# Altium project SW_Circuit.PrjPcb
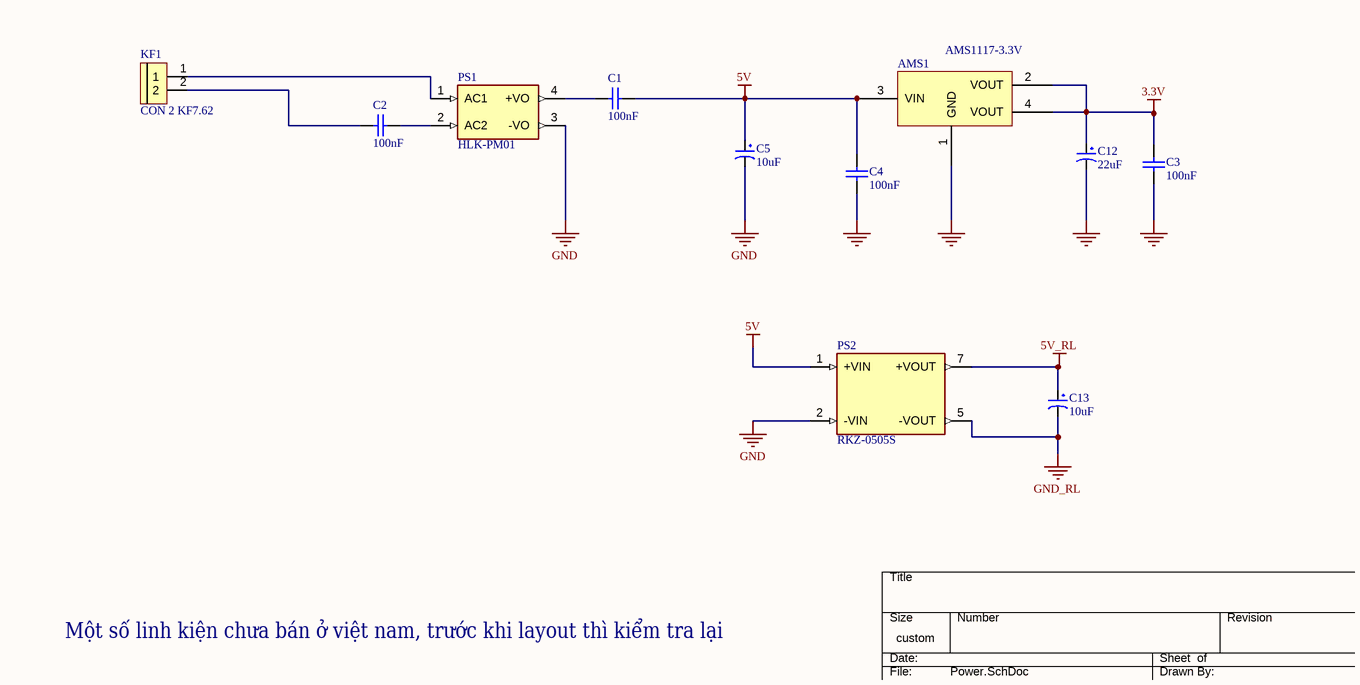
[diagram p0: Power.SchDoc]
3 sheets, 45 parts. Net scope: global (net labels, ports and power ports of the same name join across sheets).
Board file: PCB1.PcbDoc
Sheets:
  Power.SchDoc
  MCU.SchDoc
  Switch.SchDoc

## Sheet Power.SchDoc
size 254 x 127 mm; SheetNumber: 1; SheetTotal: 3

### Parts
(Parts that share a designator on the sheet are numbered #1, #2 ... from top to bottom, then left to right.)
AMS1  AMS1117-3.3V  [SOT223]
C1  100nF  [tu gom]
C2  100nF  [tu gom]
C3  100nF  [tu gom]
C4  100nF  [tu gom]
C5  10uF  [tu hoa 5mm]
C12  22uF  [tu hoa 5mm]
C13  10uF  [tu hoa 5mm]
KF1#1  CON 2 KF7.62  [CON 2 KF7.62]
PS1  HLK-PM01  [CONV_HLK-PM01]
PS2  RKZ-0505S  [CONV_RKZ-0505S]

### Nets
3.3V: AMS1.2(VOUT) AMS1.4(VOUT) C3.1 C12.1
5V: AMS1.3(VIN) C1.2 C4.1 C5.1 PS2.1(+VIN)
5V_RL: C13.1 PS2.7(+VOUT)
GND: AMS1.1(GND) C3.2 C4.2 C5.2 C12.2 PS1.3(-VO) PS2.2(-VIN)
GND_RL: C13.2 PS2.5(-VOUT)
NetC1_1: C1.1 PS1.4(+VO)
NetC2_1: C2.1 KF1#1.2
NetC2_2: C2.2 PS1.2(AC2)
NetKF1#1_1: KF1#1.1 PS1.1(AC1)

### Notes on the sheet
- Một số linh kiện chưa bán ở việt nam, trước khi layout thì kiểm tra lại
- DWG. NO.
- REV.
- SHT.
- THIS DOCUMENT AND THE DATA DISCLOSED HEREIN OR HEREWITH IS THE PROPERTY OF ALTIUM LIMITED AND MAY BE FREELY DISTRIBUTED IN WHOLE. NO RIGHTS ARE RESERVED OR EXPRESS OR IMPLIED WARANTEE GIVEN.
- REVISION
- DESCRIPTION
- DATE
- APPROVED
- ENG:
- APPROVALS
- PROJECT
- DSN:
- CHK:
- REFERENCE DOCUMENTS
- PROJECT REVISION:
- TITLE
- DOCUMENT REVISION:
- DESIGN ITEM:
- BOM:
- FAB DWG:
- PCB DWG:
- ASSY DWG:
- SCALE:
- SIZE
- B
- CAGE CODE
- FILE NAME
- DWG NO.
- SHEET
- OF
- REV

### Library data of the parts
AMS1 = AMS1117 SMD: Dán; Value: AMS1117-3.3V SOT223; Don_Vi: Con; Ma_Hang: MH000596; Ghi_Chu: *; Kieu_Chan: *; Chung_Loai: Dán
C1-C4 = Tu gom 15pF 50V: Cắm; Don_Vi: Con; So_Chan: 2; Ten_Linh_Kien: Tụ gốm 15P 50V; Ma_Hang: MH004767; Chung_Loai: Cắm; Kieu_Chan: *
C5 C12 C13 = Tu Hoa 0.1uF 50V 5x11: Cắm; Don_Vi: Con; So_Chan: 2; Ten_Linh_Kien: Tụ Hóa 0.1uF 50V; Ma_Hang: MH006853; Chung_Loai: Cắm; Kieu_Chan: *
KF1#1 = CON 2 KF7.62: Cắm; Ma_Hang: MH002053; Ten_Linh_Kien: CON 2 KF7.62-2P 7.62MM (Đen Thẳng); Chung_Loai: Cắm; Ghi_Chu: *; Kieu_Chan: *; Don_Vi: Con
PS1 = HLK-PM01: The HLK-PM01 is a small size low cost AC to DC converter which can take in 110V/220V AC at 50/60 Hz and give 5V 3W output. The module is can be used in designs which run on 5V and needs to be powered form the AC mains.; MF: Hi-link; SnapEDA_Link: https://www.snapeda.com/parts/hlk-pm01/Hi-link/view-part/?ref=snap; Package: None; Value: *; MP: hlk-pm01; Check_prices: https://www.snapeda.com/parts/hlk-pm01/Hi-link/view-part/?ref=eda
PS2 = RKZ-0505S: RKZ Series 2 W Single Output 5 V DC/DC Converter - SIP-7; Package: None; Price: None; Value: *; MP: RKZ-0505S; Availability: Unavailable

## Sheet MCU.SchDoc
size A; SheetNumber: 2; SheetTotal: 3
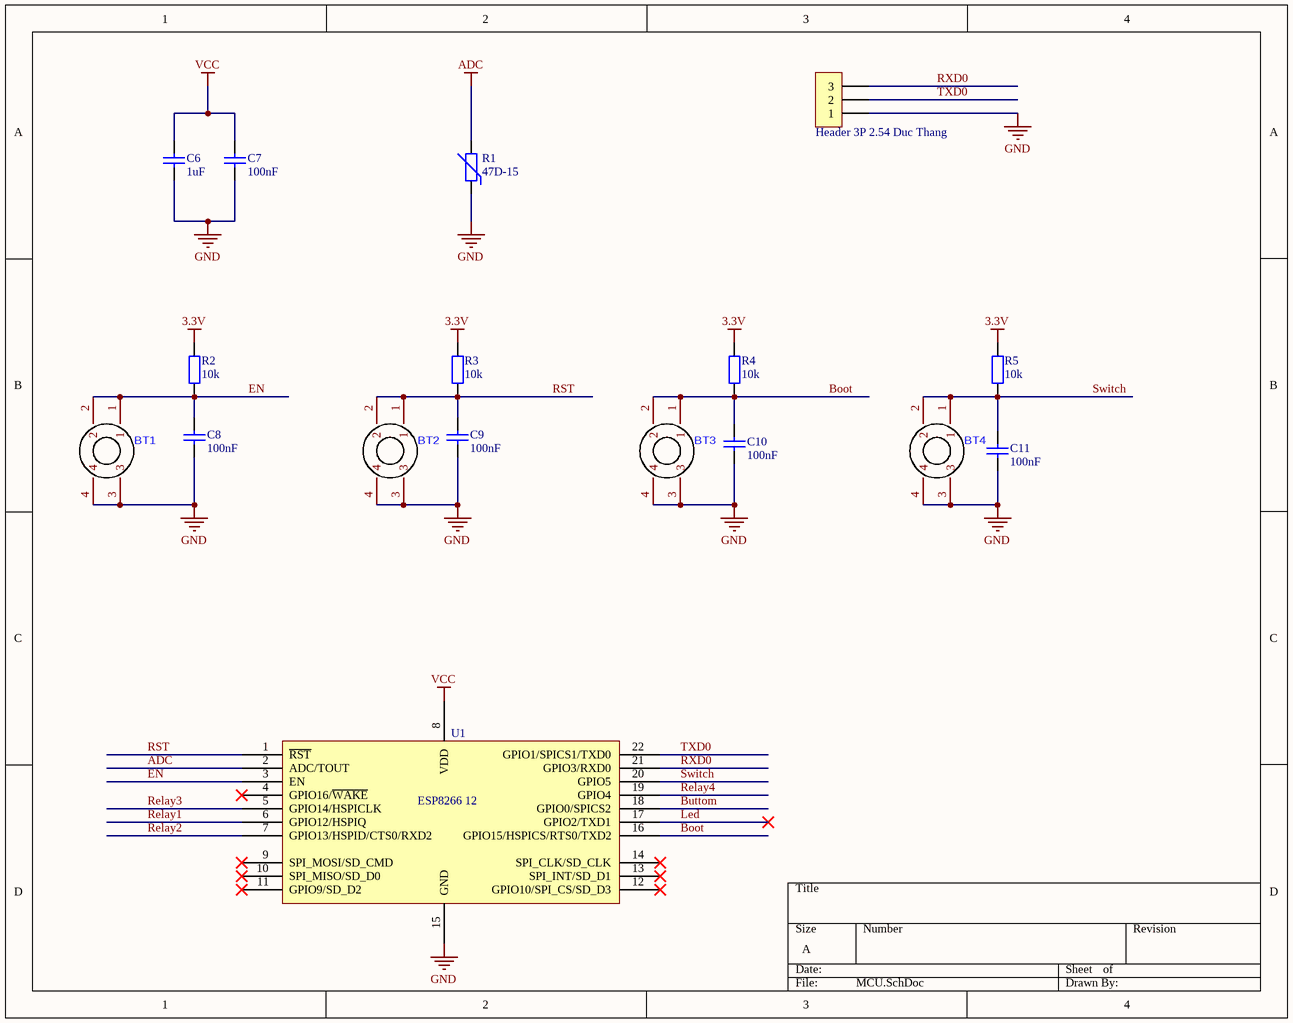
[diagram p1: MCU.SchDoc]

### Parts
BT1  Nut Nhan 4 chan 12x12  [12X12 BUTTOM red]  (value not drawn)
BT2  Nut Nhan 4 chan 12x12  [12X12 BUTTOM red]  (value not drawn)
BT3  Nut Nhan 4 chan 12x12  [12X12 BUTTOM red]  (value not drawn)
BT4  Nut Nhan 4 chan 12x12  [12X12 BUTTOM red]  (value not drawn)
C6  1uF  [tu gom]
C7  100nF  [tu gom]
C8  100nF  [tu gom]
C9  100nF  [tu gom]
C10  100nF  [tu gom]
C11  100nF  [tu gom]
H1  Header 3P 2.54 Duc Thang  [XH2.54M-3]
R1  47D-15  [tro nhiet d15]
R2  10k  [tro vach 1/2w]
R3  10k  [tro vach 1/2w]
R4  10k  [tro vach 1/2w]
R5  10k  [tro vach 1/2w]
U1  ESP8266 12  [ESP8266 12]

### Nets
3.3V: R2.2 R3.2 R4.2 R5.2
ADC: R1.2 U1.2(ADC/TOUT)
GND: BT1.3 BT1.4 BT2.3 BT2.4 BT3.3 BT3.4 BT4.3 BT4.4 C6.2 C7.2 C8.2 C9.2 C10.2 C11.2 H1.1 R1.1 U1.15(GND)
VCC: C6.1 C7.1 U1.8(VDD)
Boot: BT3.1 BT3.2 C10.1 R4.1 U1.16(GPIO15/HSPICS/RTS0/TXD2)
Buttom: U1.18(GPIO0/SPICS2)
EN: BT1.1 BT1.2 C8.1 R2.1 U1.3(EN)
Led: U1.17(GPIO2/TXD1)
Relay1: U1.6(GPIO12/HSPIQ)
Relay2: U1.7(GPIO13/HSPID/CTS0/RXD2)
Relay3: U1.5(GPIO14/HSPICLK)
Relay4: U1.19(GPIO4)
RST: BT2.1 BT2.2 C9.1 R3.1 U1.1(~{RST})
RXD0: H1.3 U1.21(GPIO3/RXD0)
Switch: BT4.1 BT4.2 C11.1 R5.1 U1.20(GPIO5)
TXD0: H1.2 U1.22(GPIO1/SPICS1/TXD0)

Not connected (* = marked no-connect by the designer): U1 4(GPIO16/~{WAKE})* 9(SPI_MOSI/SD_CMD)* 10(SPI_MISO/SD_D0)* 11(GPIO9/SD_D2)* 12(GPIO10/SPI_CS/SD_D3)* 13(SPI_INT/SD_D1)* 14(SPI_CLK/SD_CLK)*

### Library data of the parts
C6-C11 = Tu gom 15pF 50V: as C1 on sheet Power; Chung_Loai: Cắm; Kieu_Chan: *
H1 = Header 3P 2.54 Duc Thang: Cắm; Ten_Linh_Kien: Header 3P XH2.54-3P Đực Thẳng; Don_Vi: Con; Ma_Hang: MH001292; Chung_Loai: Cắm
R1 = Tro Nhiet NTC 47D-15: Cắm; Don_Vi: Con; So_Chan: 2; Ten_Linh_Kien: Điện Trở Nhiệt NTC 47D-15; Ma_Hang: MH005858; Chung_Loai: Cắm; Kieu_Chan: *
R2-R5 = Tro Vach 1/2W 5% 47K: Cắm; Don_Vi: Con; So_Chan: 2; Ten_Linh_Kien: Trở 5% 1/2w 47k; Ma_Hang: MH008002; Chung_Loai: Cắm; Kieu_Chan: *
U1 = ESP8266 12: ESP8266 12 22 Pin; IC: ESP8266-EX; Vendor: Ai-thinker

## Sheet Switch.SchDoc
size A; SheetNumber: 3; SheetTotal: 3
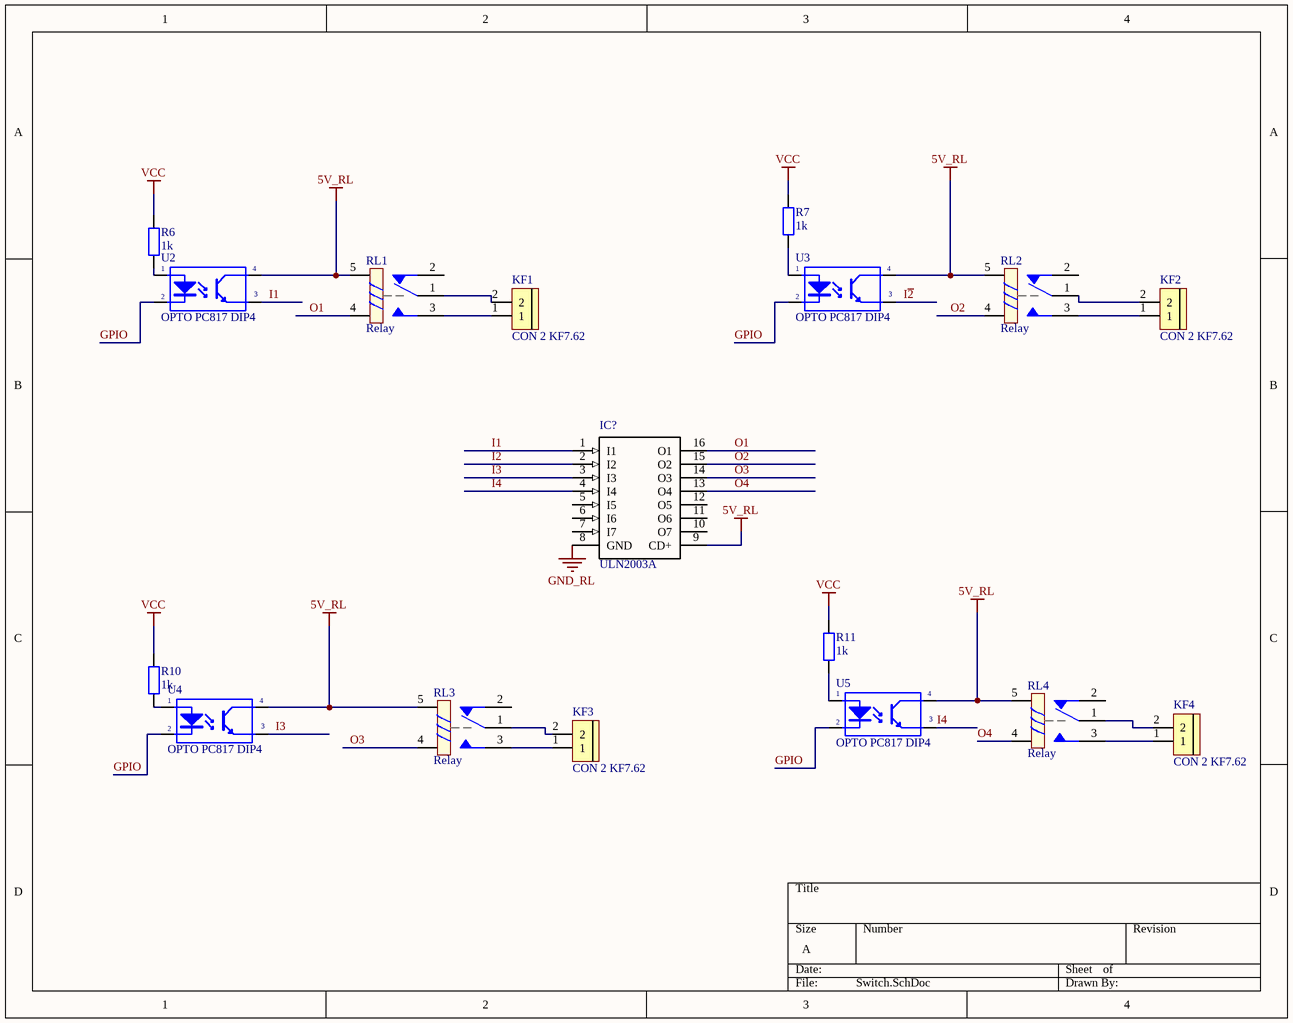
[diagram p2: Switch.SchDoc]

### Parts
(Parts that share a designator on the sheet are numbered #1, #2 ... from top to bottom, then left to right.)
IC?  ULN2003A  [*DIL16]
KF1#2  CON 2 KF7.62  [CON 2 KF7.62]
KF2  CON 2 KF7.62  [CON 2 KF7.62]
KF3  CON 2 KF7.62  [CON 2 KF7.62]
KF4  CON 2 KF7.62  [CON 2 KF7.62]
R6  1k  [tro vach 1/2w]
R7  1k  [tro vach 1/2w]
R10  1k  [tro vach 1/2w]
R11  1k  [tro vach 1/2w]
RL1  Relay  [Relay 5 Chan SRD]
RL2  Relay  [Relay 5 Chan SRD]
RL3  Relay  [Relay 5 Chan SRD]
RL4  Relay  [Relay 5 Chan SRD]
U2  OPTO PC817 DIP4  [DIP4]
U3  OPTO PC817 DIP4  [DIP4]
U4  OPTO PC817 DIP4  [DIP4]
U5  OPTO PC817 DIP4  [DIP4]

### Nets
5V_RL: IC?.9(CD+) RL1.5 RL2.5 RL3.5 RL4.5 U2.4(C) U3.4(C) U4.4(C) U5.4(C)
GND_RL: IC?.8(GND)
VCC: R6.2 R7.2 R10.2 R11.2
GPIO: U2.2(K) U3.2(K) U4.2(K) U5.2(K)
I1: IC?.1(I1) U2.3(E)
I~{2}: IC?.2(I2) U3.3(E)
I3: IC?.3(I3) U4.3(E)
I4: IC?.4(I4) U5.3(E)
O1: IC?.16(O1) RL1.4
O2: IC?.15(O2) RL2.4
O3: IC?.14(O3) RL3.4
O4: IC?.13(O4) RL4.4
NetKF1#2_1: KF1#2.1 RL1.3
NetKF1#2_2: KF1#2.2 RL1.1
NetKF2_1: KF2.1 RL2.3
NetKF2_2: KF2.2 RL2.1
NetKF3_1: KF3.1 RL3.3
NetKF3_2: KF3.2 RL3.1
NetKF4_1: KF4.1 RL4.3
NetKF4_2: KF4.2 RL4.1
NetR6_1: R6.1 U2.1(A)
NetR7_1: R7.1 U3.1(A)
NetR10_1: R10.1 U4.1(A)
NetR11_1: R11.1 U5.1(A)

Not connected (* = marked no-connect by the designer): IC? 5(I5) 6(I6) 7(I7) 10(O7) 11(O6) 12(O5); RL1 2; RL2 2; RL3 2; RL4 2

### Library data of the parts
IC? = ULN2003A: / DARLINGTON ARRAY 7NPN, 2003, DIP16; Transistor Polarity:NPN; Collector Emitter Voltage V(br)ceo:50V; DC Collector Current:500mA; DC Current Gain hFE:1000; Operating Temperature Range:-20Â°C to +85Â°C; Transistor Case Style:DIP; No. of Pins:16; SVHC:No SVHC (20-Jun-2011); Base Number:2003; Current Ic Continuous a Max:500mA; Device Marking:ULN2003A; IC Generic Number:2003; Input Type:TTL, CMOS 5V; Input Voltage Max:5V; Logic Function Number:2003; Module Configuration:Seven; No. of Channels:7; No. of Transistors:7; Operating Temperature Max:85Â°C; Operating Temperature Min:-20Â°C; Output Current Max:500mA; Output Type:Open Collector; Output Voltage Max:50V; Package / Case:DIP; Termination Type:Through Hole; Transistor Type:Power Darlington /; MF: STMicroelectronics; SnapEDA_Link: https://www.snapeda.com/parts/ULN2003A/STMicroelectronics/view-part/?ref=snap; Package: DIP-16 Sprague; MP: ULN2003A; Check_prices: https://www.snapeda.com/parts/ULN2003A/STMicroelectronics/view-part/?ref=eda; Value: *
KF1#2 KF2-KF4 = CON 2 KF7.62: as KF1#1 on sheet Power; Chung_Loai: Cắm; Ghi_Chu: *; Kieu_Chan: *; Don_Vi: Con
R6 R7 R10 R11 = Tro Vach 1/2W 5% 1M: Cắm; Don_Vi: Con; So_Chan: 2; Ten_Linh_Kien: Trở 5% 1/2w 1M; Ma_Hang: MH007242; Chung_Loai: Cắm; Kieu_Chan: *
RL1-RL4 = Relay 5 Chan SRD: Relay 5 Chan; Ma_Hang: MH009374; Ten: Relay 5V10A SRD-05VDC-SL-C Chính Hãng
U2-U5 = OPTO PC817 DIP4: Single Opto; Value: PC817

## Nets that join several sheets
3.3V: Power (AMS1.2 AMS1.4 C3.1 C12.1), MCU (R2.2 R3.2 R4.2 R5.2)
5V_RL: Power (C13.1 PS2.7), Switch (9 pins)
GND: Power (7 pins), MCU (17 pins)
GND_RL: Power (C13.2 PS2.5), Switch (IC?.8)
VCC: MCU (C6.1 C7.1 U1.8), Switch (R6.2 R7.2 R10.2 R11.2)